# Altium schematic sheet sheet6_mechanical.SchDoc: Proximo: Mechanical
size A4; Organization: Ideetron B.V.; Address1: Dorpstraat 81; Address2: 3941 JL Doorn; Address3: 3941 JL Doorn; Address4: The Netherlands; SheetNumber: 6
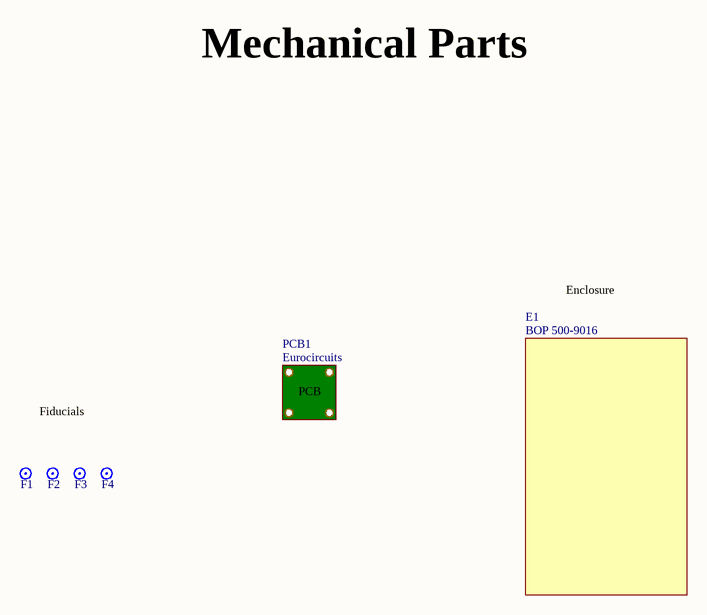
[diagram p0: sheet6_mechanical.SchDoc]

## Parts
E1  BOP 500-9016  (mechanical)
F1  Fiducial  [Fiducial]  (value not drawn)  (no BOM)
F2  Fiducial  [Fiducial]  (value not drawn)  (no BOM)
F3  Fiducial  [Fiducial]  (value not drawn)  (no BOM)
F4  Fiducial  [Fiducial]  (value not drawn)  (no BOM)
PCB1  PCB  (value not drawn)  (mechanical)

## Notes on the sheet
- Mechanical Parts
- Enclosure
- Fiducials
- Title
- Size:
- A4
- Number:
- Revision:
- Date:
- Time:
- Sheet
- of

## Library data of the parts
E1 = Bopla behuizing: Bopla ABS enclosure; Sponsor: PM Komponenten; Manufacturer: Bopla; Value: BOP 500-9016; Supplier 1: *; Supplier Part Number 1: *; Manufacturer Part Number: BOP 500-9016
PCB1 = PCB: Eurocircuits; Remark: Added for automatic inclusion in the BOM; Sponsor: Eurocircuits
F1-F4 = Fiducial: value: Fiducial